# EAGLE design usbttl_gps (EAGLE 5.11)
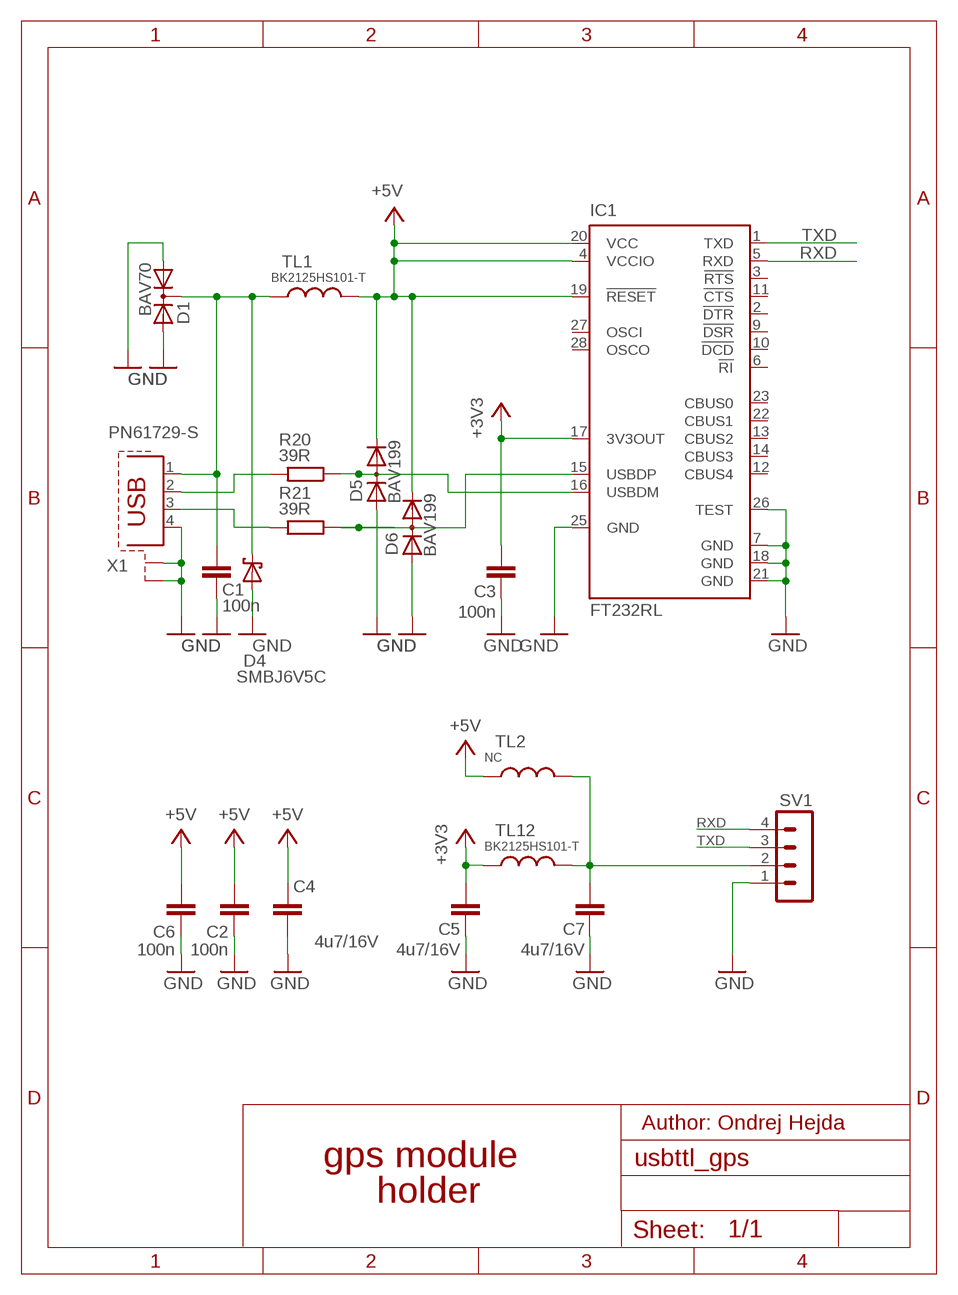
[diagram p0: schematic, sheet 1]

## Parts
C1  100n  C-EUC0805WF  [C0805WF]
C2  100n  C-EUC0805WF  [C0805WF]
C3  100n  C-EUC0805WF  [C0805WF]
C4  4u7/16V  C-EUC1206WF  [C1206WF]
C5  4u7/16V  C-EUC1206  [C1206]
C6  100n  C-EUC0805WF  [C0805WF]
C7  4u7/16V  C-EUC1206  [C1206]
D1  BAV70  [SOT23]
D4  SMBJ6V5C  TRANZIL_UNISBM_FW_UNI  [SMB_FW_UNI]
D5  BAV199  [SOT23]
D6  BAV199  [SOT23]
IC1  FT232RL  [SSOP28]
R20  39R  R-EU_R1206  [R1206]
R21  39R  R-EU_R1206  [R1206]
SV1  MA04-1  [MA04-1]
TL1  BK2125HS101-T  FERR_BOURNS_3261R805WF  [R805WF]
TL2  NC  FERR_BOURNS_3261R805WF  [R805WF]
TL12  BK2125HS101-T  FERR_BOURNS_3261R805WF  [R805WF]
X1  PN61729-S  [PN61729-S]

## Nets
+3V3: C3.1 C5.1 IC1.17(3V3OUT) TL12.2
+5V: C2.1 C4.2 C6.1 D5.2(C) D6.2(C) IC1.4(VCCIO) IC1.19(!RESET) IC1.20(VCC) TL1.1 TL2.2
GND: C1.2 C2.2 C3.2 C4.1 C5.2 C6.2 C7.2 D1.1(A1) D1.2(A2) D4.A D5.1(A) D6.1(A) IC1.7(GND) IC1.18(GND) IC1.21(GND) IC1.25(GND) IC1.26(TEST) SV1.1 X1.4 X1.S1 X1.S2
N$1: R20.2 X1.2
N$2: D6.3(AC) IC1.15(USBDP) R21.1
N$3: C1.1 D1.3(K) D4.C TL1.2 X1.1
N$8: D5.3(AC) IC1.16(USBDM) R20.1
N$9: R21.2 X1.3
PWR_OUT: C7.1 SV1.2 TL2.1 TL12.1
RXD: IC1.5(RXD) SV1.4
TXD: IC1.1(TXD) SV1.3
Unconnected: IC1.2(!DTR) IC1.3(!RTS) IC1.6(!RI) IC1.9(!DSR) IC1.10(!DCD) IC1.11(!CTS) IC1.12(CBUS4) IC1.13(CBUS2) IC1.14(CBUS3) IC1.22(CBUS1) IC1.23(CBUS0) IC1.27(OSCI) IC1.28(OSCO)

## Notes on the sheet
- Author: Ondrej Hejda
- gps module
- holder

## Library data of the parts
C1-C7 = rcl:C-EU: CAPACITOR, European symbol
D1 = DIODE:BAV70
D4 = DIODE:TRANZIL_UNI
D5 D6 = DIODE:BAV199: DIODE low-leakage double diode
IC1 = ftdichip:FT232R: Source: http://www.ftdichip.com/Documents/DataSheets/DS_FT232R_v104.pdf
R20 R21 = rcl:R-EU_: RESISTOR, European symbol
SV1 = con-lstb:MA04-1: PIN HEADER
TL1 TL2 TL12 = 0joe1:FERR_BOURNS_3261
X1 = con-berg:PN61729-S: BERG USB connector

## Board
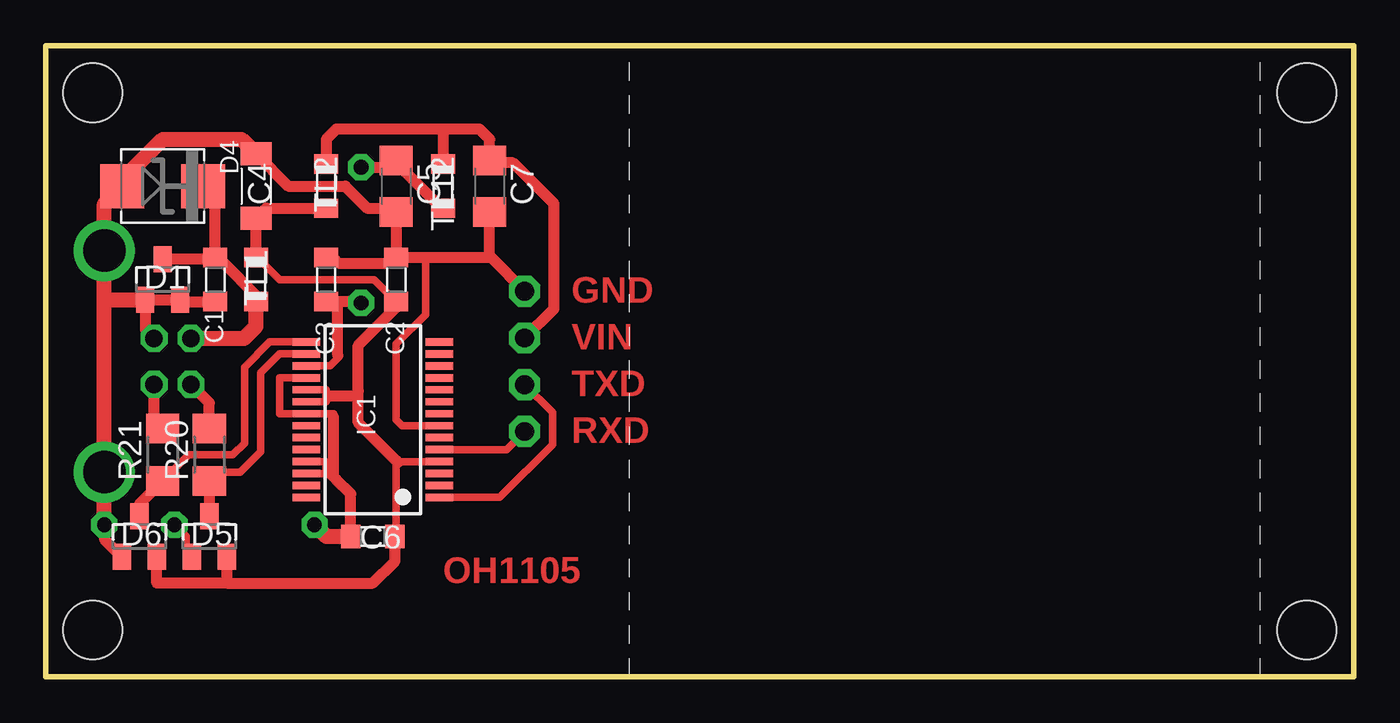
[diagram p1: board, top side]
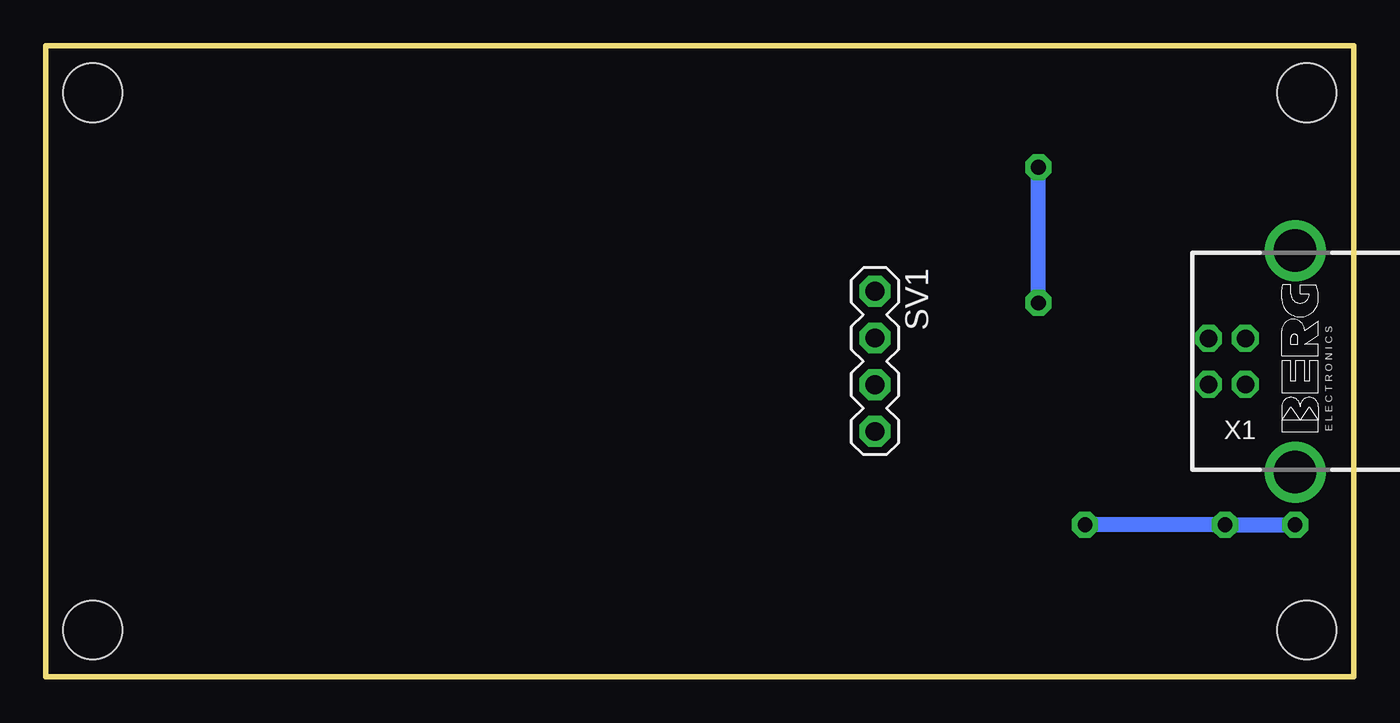
[diagram p2: board, bottom side, seen from below]

Size 71.12 x 34.29 mm. Coordinates in mm from the lower left corner, seen from the top.
Outline: 0,34.29 0,0 71.12,0 71.12,34.29 0,34.29
Copper layers (1*16): Top 0.035mm / dielectric 1.5mm / Bottom 0.035mm
Design rules "default *": minimum track width 10mil, minimum drill 18mil, track to track 8mil, track to pad 8mil, pad to pad 8mil, via to via 8mil, smd to smd 8mil, copper to edge 40mil, drill to drill 8mil, minimum pad ring 10mil, minimum via ring 8mil, stop-mask expansion 4mil, vias tented up to drill 0mil, thermal gap 10mil
Holes 3.2 mm at 2.54,31.75 2.54,2.54 68.58,2.54 68.58,31.75
bRestrict: area 21.6,14 to 25.2,20.5; area 37.1,34.6 to 47.9,36.8; area 65.7,-3.2 to 83.5,-0.3

### Footprints (pad centres in the part's own frame; a part is rotated, then mirrored left to right if it is on the bottom)
C0805WF = smd 1.05 x 1.3: 1 -1.2,0; 2 1.2,0
C1206WF = smd 1.25 x 1.7: 1 -1.75,0; 2 1.75,0
C1206 = smd 1.6 x 1.8: 1 -1.4,0; 2 1.4,0
SOT23 = smd 1 x 1.4: 1 -0.95,-1.1; 2 0.95,-1.1; 3 0,1.1
SMB_FW_UNI = smd 2.4 x 2.4: A 2.2,0; C -2.2,0
SSOP28 = smd 0.4 x 1.5: 1 -4.225,-3.625; 2 -3.575,-3.625; 3 -2.925,-3.625; 4 -2.275,-3.625; 5 -1.625,-3.625; 6 -0.975,-3.625; 7 -0.325,-3.625; 8 0.325,-3.625; 9 0.975,-3.625; 10 1.625,-3.625; 11 2.275,-3.625; 12 2.925,-3.625; 13 3.575,-3.625; 14 4.225,-3.625; 15 4.225,3.625; 16 3.575,3.625; 17 2.925,3.625; 18 2.275,3.625; 19 1.625,3.625; 20 0.975,3.625; 21 0.325,3.625; 22 -0.325,3.625; 23 -0.975,3.625; 24 -1.625,3.625; 25 -2.275,3.625; 26 -2.925,3.625; 27 -3.575,3.625; 28 -4.225,3.625
R1206 = smd 1.6 x 1.803: 1 -1.422,0; 2 1.422,0
MA04-1 = drill 1.016 octagon: 1 -3.81,0; 2 -1.27,0; 3 1.27,0; 4 3.81,0
R805WF = smd 1.05 x 1.3: 1 -1.2,0; 2 1.2,0
PN61729-S = drill 0.95 octagon: 1 1.25,4.71; 2 -1.25,4.71; 3 -1.25,2.71; 4 1.25,2.71 | drill 2.3 pad 2.9 round: S1 -6.02,0; S2 6.02,0

### Placement (x,y rotation side)
C1  9.21,21.59 270 top
C2  19.05,21.59 90 top
C3  15.24,21.59 90 top
C4  11.43,26.67 270 top
C5  19.05,26.67 270 top
C6  17.78,7.62 180 top
C7  24.13,26.67 270 top
D1  6.35,21.59 0 top
D4  6.35,26.67 180 top
D5  8.89,7.62 0 top
D6  5.08,7.62 0 top
IC1  17.78,13.97 90 top
R20  8.89,12.06 90 top
R21  6.35,12.06 90 top
SV1  26.04,17.14 270 bottom
TL1  11.43,21.59 270 top
TL2  15.24,26.67 270 top
TL12  21.59,26.67 270 top
X1  3.18,17.14 90 bottom

### Tracks (layer width: path | path; a pad name or v marks a point on that pad's centre or on a via)
+3V3  (via drill 0.8 pad 1.42)
  Top 0.406: 15.88,17.46 15.88,17.3 15.47,16.89 IC1.17
  Top 0.61: 15.88,20.39 C3.1 | 15.88,17.46 15.88,20.39 | 15.88,20.39 15.88,20.4 17.07,20.4 v17.14,20.32 | 21.39,25.27 TL12.2 21.52,25.47 19.05,27.94 C5.1 18.68,27.7 v17.14,27.7
  Bottom 0.813: v17.14,20.32 v17.14,27.7
+5V
  Top 0.406: C2.1 17.85,21.59 12.7,21.59 11.5,22.79 TL1.1 | IC1.20 15.24,14.94 15.24,15.24 | 15.24,15.24 15.24,15.6 IC1.19 | 15.4,15.24 15.24,15.24 | IC1.4 19.32,11.7 19.05,11.43 | 19.05,11.43 19.05,7.69 C6.1 | 19.05,11.43 19.05,11.75
  Top 0.61: D6.2 6.03,5.08 9.84,5.08 | D5.2 9.84,5.08 | 9.84,5.08 17.78,5.08 18.98,6.28 C6.1 | TL1.1 C4.2 11.98,25.47 TL2.2 | 16.99,15.56 16.99,18.02 19.05,20.08 C2.1 | 16.99,15.56 16.91,15.24 15.4,15.24 | 19.05,11.75 16.99,13.81 16.99,15.56
GND  (via drill 0.5 pad 2.54, 0.8 pad 1.42)
  Top 0.406: IC1.26 15.24,11.04 15.24,11.43 | 15.32,11.19 15.24,11.43 | 15.24,11.43 15.24,11.7 IC1.25 | IC1.18 12.7,16.25 12.7,14.29 IC1.21 15.63,14.29 15.64,14.29 15.64,14.13 | v6.98,8.25 7.62,7.62 7.62,6.84 D5.1 | IC1.7 19.38,13.64 19.05,13.97 19.05,18.1 20.64,19.69 20.64,22.71 20.56,22.79
  Top 0.61: X1.4 5.4,18.88 D1.1 D1.2 7.4,20.39 C1.2 | D6.1 3.18,7.47 v3.18,8.25 | C2.2 18.72,22.46 15.95,22.46 15.63,22.79 C3.2 | SV1.1 24.2,22.79 24.13,22.79 | C2.2 20.56,22.79 24.13,22.79 | 24.13,22.79 C7.2 | C2.2 C5.2 18.84,25.48 17.46,25.48 16.27,26.67 13.18,26.67 C4.1 | C6.2 16.58,9.93 15.8,10.72 15.64,10.87 | 15.64,10.87 15.32,11.19 | 15.64,10.87 15.64,14.13
  Top 0.813: C4.1 10.64,29.21 6.35,29.21 4.15,27.01 D4.A 3.18,25.7 v3.18,23.18 X1.S2 3.18,20.49 | 3.18,20.49 X1.S1 v3.18,11.11 v3.18,8.25 | 3.18,20.49 D1.1 | C6.2 15.24,7.62 v14.61,8.25
  Bottom 0.813: v3.18,8.25 v6.98,8.25 v14.61,8.25
N$1
  Top 0.61: X1.2 8.89,14.89 R20.2
N$2
  Top 0.406: R21.1 7.77,12.06 10.16,12.06 10.79,12.7 10.79,16.83 12.16,18.2 IC1.15
  Top 0.61: R21.1 5.08,9.37 D6.3
N$3
  Top 0.61: TL1.2 11.43,20.72 9.71,22.44 C1.1 | C1.1 8.96,22.69 D1.3 | D4.C 9.21,26.01 C1.1
  Top 0.813: X1.1 10.78,18.39 11.43,19.05 TL1.2
N$4  (via drill 0.5 pad 1.27)
  other vias: 5.87,18.42
N$5  (via drill 0.5 pad 1.27)
  other vias: 7.86,18.42
N$6  (via drill 0.5 pad 1.27)
  other vias: 7.94,15.87
N$7  (via drill 0.5 pad 1.27)
  other vias: 5.87,15.87
N$8
  Top 0.406: R20.1 9.36,11.11 10.56,11.11 11.67,12.22 11.67,16.51 12.7,17.55 IC1.16
  Top 0.61: R20.1 D5.3
N$9
  Top 0.61: X1.3 5.88,13.95 R21.2
N$10  (via drill 0.5 pad 1.27)
  other vias: 17.14,20.32
N$11  (via drill 0.5 pad 1.27)
  other vias: 17.14,27.7
N$12  (via drill 0.5 pad 1.68)
  other vias: 26.04,20.96
N$13  (via drill 0.5 pad 1.68)
  other vias: 26.04,18.42
N$14  (via drill 0.5 pad 1.68)
  other vias: 26.04,15.87
N$15  (via drill 0.5 pad 1.68)
  other vias: 26.04,13.33
N$16  (via drill 0.5 pad 1.27)
  other vias: 14.61,8.25
N$17  (via drill 0.5 pad 1.27)
  other vias: 6.98,8.25
N$18  (via drill 0.5 pad 1.27)
  other vias: 3.18,8.25
PWR_OUT
  Top 0.61: 21.59,29.77 23.57,29.77 24.13,29.21 C7.1 | 21.59,29.77 TL12.1 | C7.1 24.58,27.62 | SV1.2 27.62,20 27.62,25.72 25.4,27.94 24.26,27.94 C7.1 | 21.59,29.77 15.8,29.77 15.24,29.21 TL2.1
RXD
  Top 0.406: IC1.5 25.05,12.35 SV1.4
TXD
  Top 0.406: IC1.1 24.67,9.74 27.54,12.62 27.54,14.37 SV1.3

### Text on the board
Top: GND | VIN | TXD | RXD | OH1105
tStop: TOP_SOLDER_STOP
bStop: BOTTOM_SOLDER_STOP
tCream: TOP_PASTE
Measures: 71.12 | 34.29